# Altium schematic sheet Block Diagram.SchDoc: Block Diagram
size 292 x 193 mm; SheetNumber: 1; SheetTotal: 18
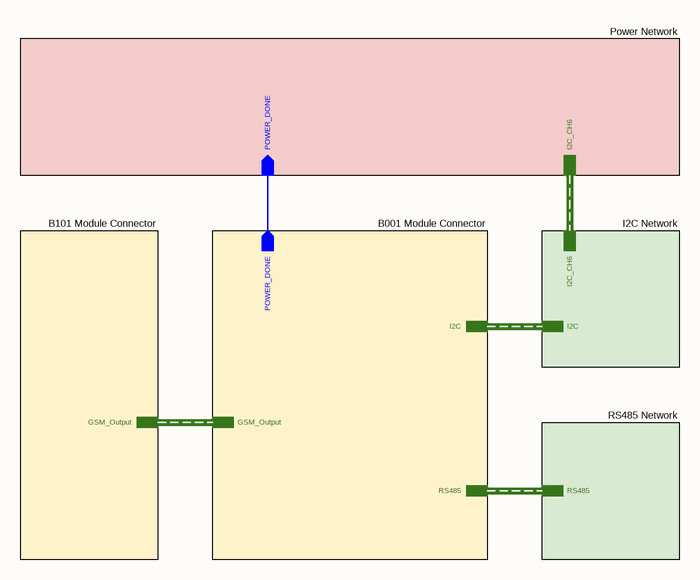
[diagram p0: Block Diagram.SchDoc]

## Sub-sheets
B001 Module Connector = B001 PCIe Socket.SchDoc: I2C (harness I2C), GSM_Output (harness GSM_Output), RS485 (harness RS485), POWER_DONE (out)
B101 Module Connector = B101 PCIe Socket.SchDoc: GSM_Output (harness GSM_Output)
I2C Network = I2C Network.SchDoc: I2C (harness I2C), I2C_CH6 (harness I2C_CH6)
Power Network = B802 PCIe Socket.SchDoc: POWER_DONE (in), I2C_CH6 (harness I2C_CH6)
RS485 Network = RS485 Network.SchDoc: RS485 (harness RS485)

## Nets
(unnamed): sheet B001 Module Connector/POWER_DONE, sheet Power Network/POWER_DONE

## Buses and harness runs
harness sheet B001 Module Connector/GSM_Output = sheet B101 Module Connector/GSM_Output
harness sheet B001 Module Connector/I2C = sheet I2C Network/I2C
harness sheet B001 Module Connector/RS485 = sheet RS485 Network/RS485
harness sheet I2C Network/I2C_CH6 = sheet Power Network/I2C_CH6

## Notes on the sheet
- © 2021 All rights reserved.
  This document may not, in whole or in part, be copied, photocopied, reproduced, translated or converted to any electronic or machine readable from without prior written permission of Mehmet Günce Akkoyun.
  Engineer contact : akkoyun@me.com
- Property of
- Engineer :
- Date :
- Size :
- A4
- Time :
- Project :
- Page :
- /
- Customer :
- Product ID :
- Module ID :
- Version :
- File :
- Revision :